# Altium schematic sheet Voltage Controlled Oscillator.schdoc: Voltage Controlled Oscillator
size A4; Organization: Altium Limited; Address1: L3, 12a Rodborough Rd; Address2: Frenchs Forest; Address3: NSW; Address4: Australia 2086; DocumentNumber: 1; SheetNumber: 1; SheetTotal: 1
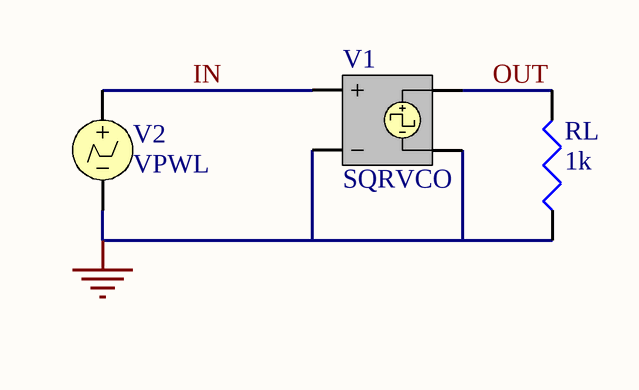
[diagram p0: Voltage Controlled Oscillator.schdoc]

## Parts
RL  1k
V1  SQRVCO
V2  VPWL

## Nets
GND: RL.2(BOT) V1.2(NC-) V1.4(N-) V2.2
IN: V1.1(NC+) V2.1
OUT: RL.1(TOP) V1.3(N+)

## Notes on the sheet
- Title
- Size:
- Date:
- A4
- Number:
- Time:
- Revision:
- Sheet
- of
- File:

## Library data of the parts
RL = RES: Resistor; Value: 1k
V1 = SQRVCO: Square Voltage Controlled Oscillator
V2 = VPWL: Piecewise Linear Voltage Source; Time-Value Pairs: 0 .1 2m .3 4m 1 6m 1.5 8m .5 10m 2.5 12m 4 14m .1; File Name: *